# EAGLE design lichtenstein_controller (EAGLE 9.4.2)
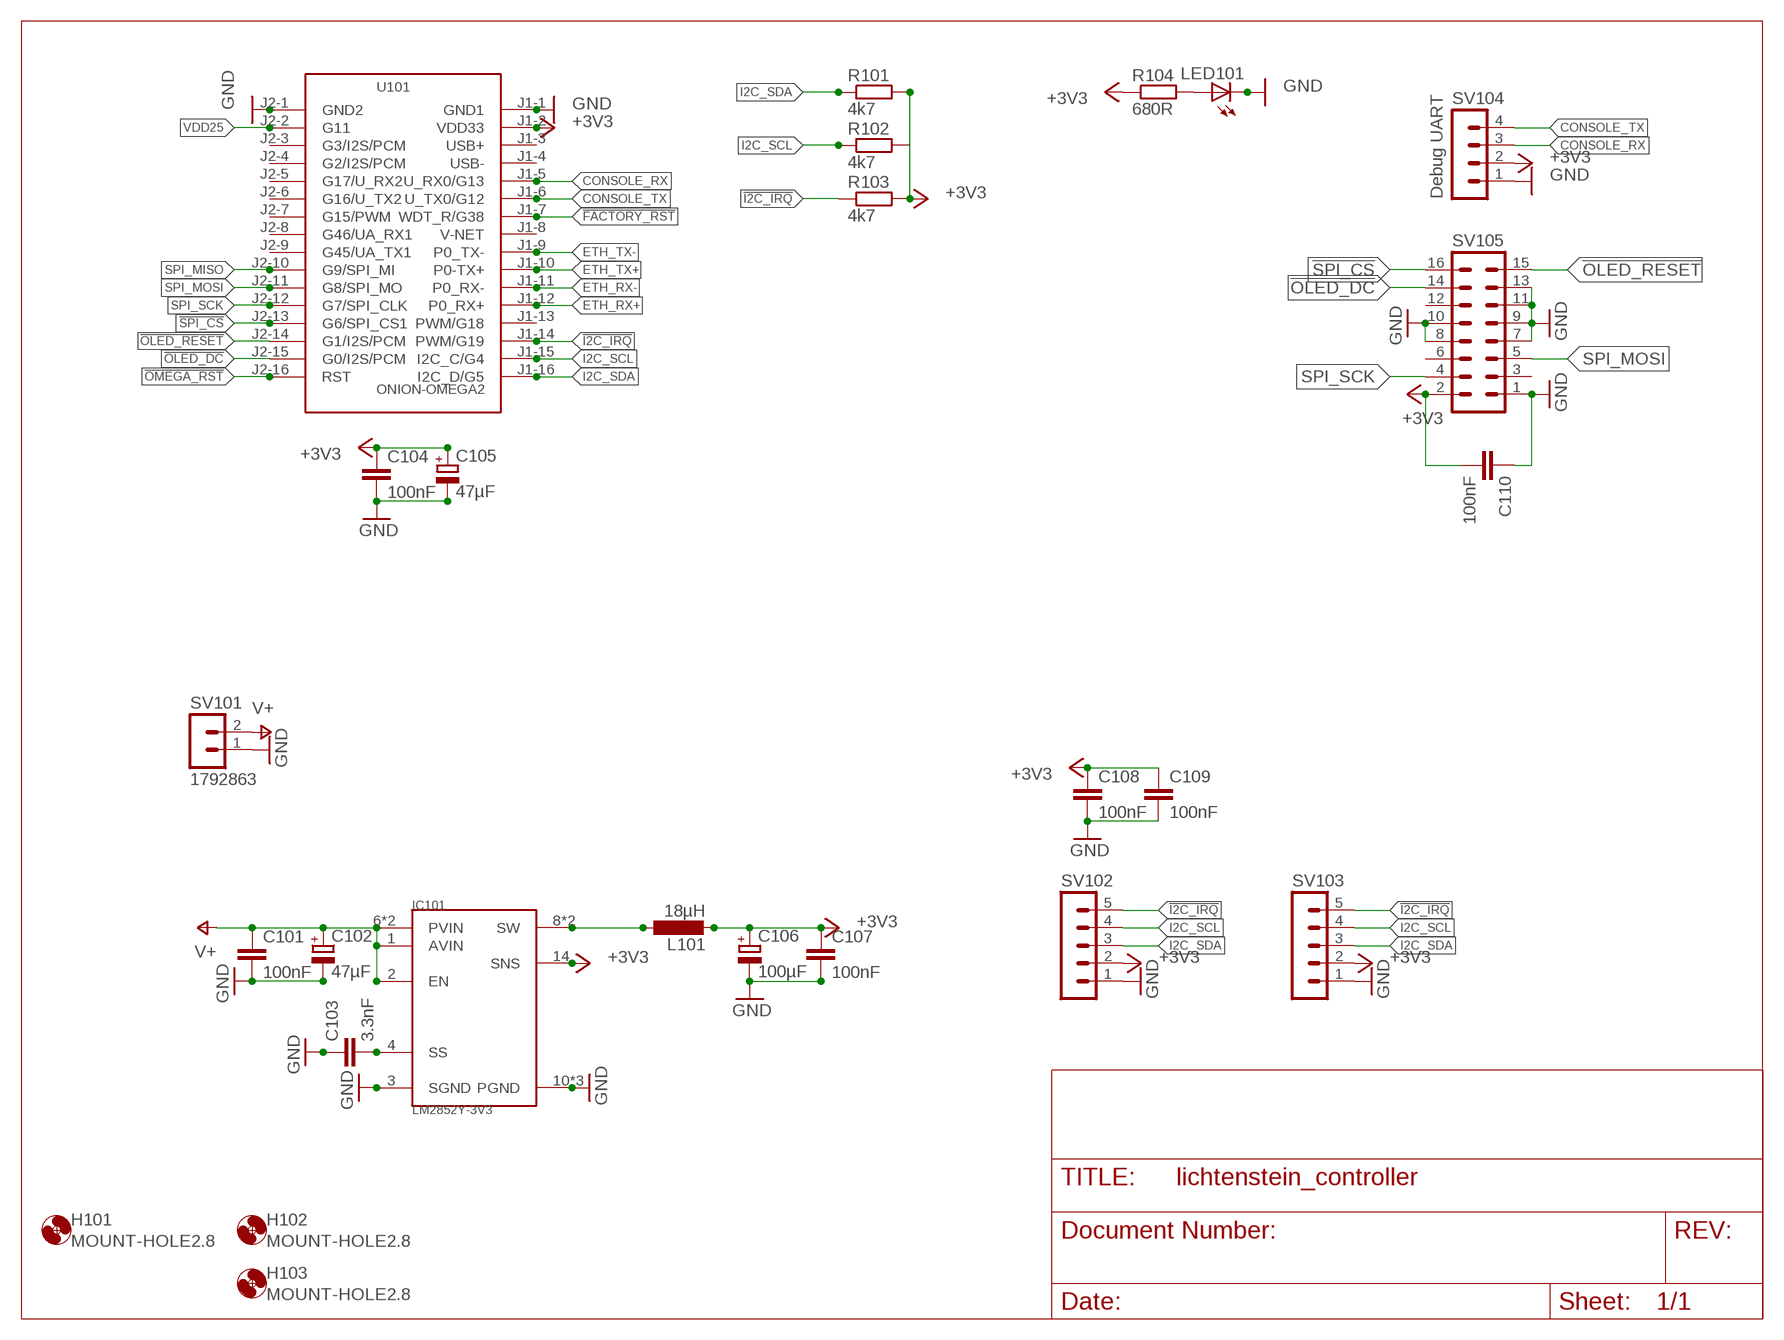
[diagram p0: schematic, sheet 1]

## Parts
C101  100nF  C-EUC0805  [C0805]
C102  47µF  CPOL-EUCT7343  [CT7343]
C103  3.3nF  C-EUC0805  [C0805]
C104  100nF  C-EUC0805  [C0805]
C105  47µF  CPOL-EUCT7343  [CT7343]
C106  100µF  CPOL-EUCT7343  [CT7343]
C107  100nF  C-EUC0805  [C0805]
C108  100nF  C-EUC0805  [C0805]
C109  100nF  C-EUC0805  [C0805]
C110  100nF  C-EUC0805  [C0805]
H101  MOUNT-HOLE2.8  [2,8]
H102  MOUNT-HOLE2.8  [2,8]
H103  MOUNT-HOLE2.8  [2,8]
IC101  LM2852Y-3V3  LM2852HTSSOP14  [HTSSOP14]
L101  18µH  SRR1050A  [SRR1050A]
LED101  LEDCHIPLED_1206  [CHIPLED_1206]
R101  4k7  R-EU_M0805  [M0805]
R102  4k7  R-EU_M0805  [M0805]
R103  4k7  R-EU_M0805  [M0805]
R104  680R  R-EU_M0805  [M0805]
SV101  1792863  [1792863]
SV102  MA05-1  [MA05-1]
SV103  MA05-1  [MA05-1]
SV104  MA04-1  [MA04-1]
SV105  MA08-2  [MA08-2]
U101  ONION-OMEGA2  [ONION-2MM-2X16]

## Nets
!FACTORY_RST: U101.J1-7(WDT_R/G38)
!I2C_IRQ: R103.1 SV102.5 SV103.5 U101.J1-14(PWM/G19)
!OLED_DC: SV105.14 U101.J2-15(G0/I2S/PCM)
!OLED_RESET: SV105.15 U101.J2-14(G1/I2S/PCM)
!OMEGA_RST: U101.J2-16(RST)
!SPI_CS: SV105.16 U101.J2-13(G6/SPI_CS1)
+3V3: C104.1 C105.+ C106.+ C107.1 C108.1 C109.1 C110.2 IC101.14(SNS) L101.P$2 R101.2 R102.2 R103.2 R104.1 SV102.2 SV103.2 SV104.2 SV105.2 U101.J1-2(VDD33)
CONSOLE_RX: SV104.3 U101.J1-5(U_RX0/G13)
CONSOLE_TX: SV104.4 U101.J1-6(U_TX0/G12)
ETH_RX+: U101.J1-12(P0_RX+)
ETH_RX-: U101.J1-11(P0_RX-)
ETH_TX+: U101.J1-10(P0-TX+)
ETH_TX-: U101.J1-9(P0_TX-)
GND: C101.2 C102.- C103.1 C104.2 C105.- C106.- C107.2 C108.2 C109.2 C110.1 IC101.3(SGND) IC101.10(PGND) IC101.11(PGND) IC101.PAD(PGND) LED101.C SV101.1 SV102.1 SV103.1 SV104.1 SV105.1 SV105.7 SV105.8 SV105.9 SV105.10 SV105.11 SV105.13 U101.J1-1(GND1) U101.J2-1(GND2)
I2C_SCL: R102.1 SV102.4 SV103.4 U101.J1-15(I2C_C/G4)
I2C_SDA: R101.1 SV102.3 SV103.3 U101.J1-16(I2C_D/G5)
N$1: LED101.A R104.2
N$7: IC101.8(SW) IC101.9(SW) L101.P$1
N$8: C103.2 IC101.4(SS)
SPI_MISO: U101.J2-10(G9/SPI_MI)
SPI_MOSI: SV105.5 U101.J2-11(G8/SPI_MO)
SPI_SCK: SV105.4 U101.J2-12(G7/SPI_CLK)
V+: C101.1 C102.+ IC101.1(AVIN) IC101.2(EN) IC101.6(PVIN) IC101.7(PVIN) SV101.2
VDD25: U101.J2-2(G11)
Unconnected: SV105.3 SV105.6 SV105.12 U101.J1-3(USB+) U101.J1-4(USB-) U101.J1-8(V-NET) U101.J1-13(PWM/G18) U101.J2-3(G3/I2S/PCM) U101.J2-4(G2/I2S/PCM) U101.J2-5(G17/U_RX2) U101.J2-6(G16/U_TX2) U101.J2-7(G15/PWM) U101.J2-8(G46/UA_RX1) U101.J2-9(G45/UA_TX1)

## Notes on the sheet
- Debug UART

## Library data of the parts
C101 C104 C107-C110 = rcl:C-EU: CAPACITOR, European symbol; MOUSER: 710-885012207072; SPICEPREFIX: C
C102 C105 = rcl:CPOL-EU: POLARIZED CAPACITOR, European symbol; MOUSER: 581-TAJD476M016RNJV; SPICEPREFIX: C
C103 = rcl:C-EU: CAPACITOR, European symbol; MOUSER: 710-885012207089; SPICEPREFIX: C
C106 = rcl:CPOL-EU: POLARIZED CAPACITOR, European symbol; MOUSER: 581-NOSD107M006; SPICEPREFIX: C
H101-H103 = holes:MOUNT-HOLE: MOUNTING HOLE with drill center marker
IC101 = lichtenstein_onion:LM2852: 2A 500/1500kHz Synchronous Buck Regulator Information <http://www.ti.com/product/lm2852/description>; MOUSER: 926-LM2852YMXA33NOPB
L101 = lichtenstein_onion:SRR1050A: SRR1050A Series - Shielded Power Inductors Datasheet <https://www.mouser.com/datasheet/2/54/rr1050a-964771.pdf>; MOUSER: 652-SRR1050A-180Y
LED101 = led:LED: LED OSRAM: - CHIPLED LG R971, LG N971, LY N971, LG Q971, LY Q971, LO R971, LY R971 LH N974, LH R974 LS Q976, LO Q976, LY Q976 LO Q996 - Hyper CHIPLED LW Q18S LB Q993, LB Q99A, LB R99A - SideLED LS A670, LO A670, LY A670, LG A670, LP A670 LB A673, LV A673, LT A673, LW A673 LH A674 LY A675 LS A676, LA A676, LO A676, LY A676, LW A676 LS A679, LY A679, LG A679 - Hyper Micro SIDELED® LS Y876, LA Y876, LO Y876, LY Y876 LT Y87S - SmartLED LW L88C, LW L88S LB L89C, LB L89S, LG L890 LS L89K, LO L89K, LY L89K LS L896, LA L896, LO L896, LY L896 - TOPLED LS T670, LO T670, LY T670, LG T670, LP T670 LSG T670, LSP T670, LSY T670, LOP T670, LYG T670 LG T671, LOG T671, LSG T671 LB T673, LV T673, LT T673, LW T673 LH T674 LS T676, LA T676, LO T676, LY T676, LB T676, LH T676, LSB T676, LW T676 LB T67C, LV T67C, LT T67C, LS T67K, LO T67K, LY T67K, LW E67C LS E67B, LA E67B, LO E67B, LY E67B, LB E67C, LV E67C, LT E67C LW T67C LS T679, LY T679, LG T679 LS T770, LO T770, LY T770, LG T770, LP T770 LB T773, LV T773, LT T773, LW T773 LH T774 LS E675, LA E675, LY E675, LS T675 LS T776, LA T776, LO T776, LY T776, LB T776 LHGB T686 LT T68C, LB T68C - Hyper Mini TOPLED® LB M676 - Mini TOPLED Santana® LG M470 LS M47K, LO M47K, LY M47K Source: http://www.osram.convergy.de LUXEON: - LUMILED® LXK2-PW12-R00, LXK2-PW12-S00, LXK2-PW14-U00, LXK2-PW14-V00 LXK2-PM12-R00, LXK2-PM12-S00, LXK2-PM14-U00 LXK2-PE12-Q00, LXK2-PE12-R00, LXK2-PE12-S00, LXK2-PE14-T00, LXK2-PE14-U00 LXK2-PB12-K00, LXK2-PB12-L00, LXK2-PB12-M00, LXK2-PB14-N00, LXK2-PB14-P00, LXK2-PB14-Q00 LXK2-PR12-L00, LXK2-PR12-M00, LXK2-PR14-Q00, LXK2-PR14-R00 LXK2-PD12-Q00, LXK2-PD12-R00, LXK2-PD12-S00 LXK2-PH12-R00, LXK2-PH12-S00 LXK2-PL12-P00, LXK2-PL12-Q00, LXK2-PL12-R00 Source: www.luxeon.com KINGBRIGHT: KA-3528ASYC Source: www.kingbright.com; MOUSER: 604-APTR3216SGC
R101-R103 = rcl:R-EU_: RESISTOR, European symbol; MOUSER: 652-CR0805-FX4701GLF; SPICEPREFIX: R
R104 = rcl:R-EU_: RESISTOR, European symbol; MOUSER: 652-CR0805-FX6800GLF; SPICEPREFIX: R
SV101 = lichtenstein_onion:1792863: PCB terminal block - PTS 1,5/ 2-5,0-H - 1792863 Footprint Proven Information <https://www.phoenixcontact.com/online/portal/us?uri=pxc-oc-itemdetail:pid=1792863&library=usen&tab=1>; MOUSER: 651-1792863
SV102 SV103 = con-lstb:MA05-1: PIN HEADER; OC_FARNELL: unknown; OC_NEWARK: unknown
SV104 = con-lstb:MA04-1: PIN HEADER; OC_FARNELL: unknown; OC_NEWARK: unknown
SV105 = con-lstb:MA08-2: PIN HEADER; OC_FARNELL: unknown; OC_NEWARK: unknown
U101 = lichtenstein_onion:ONION-OMEGA2: Onion Omega; MOUSER: 353-OM-O2P

## Board
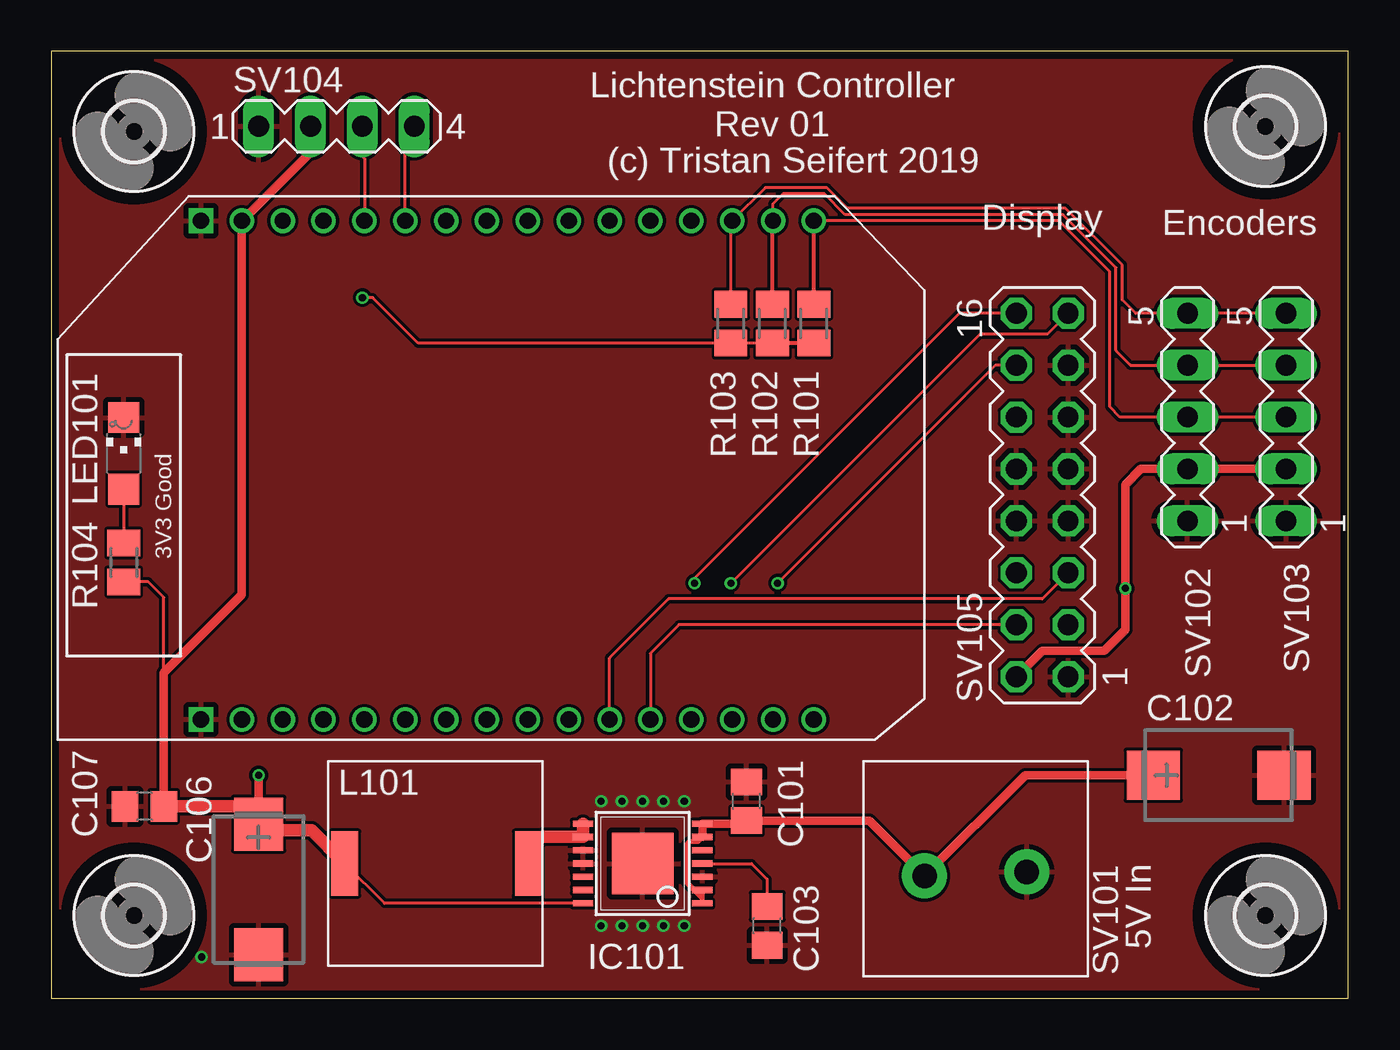
[diagram p1: board, top side]
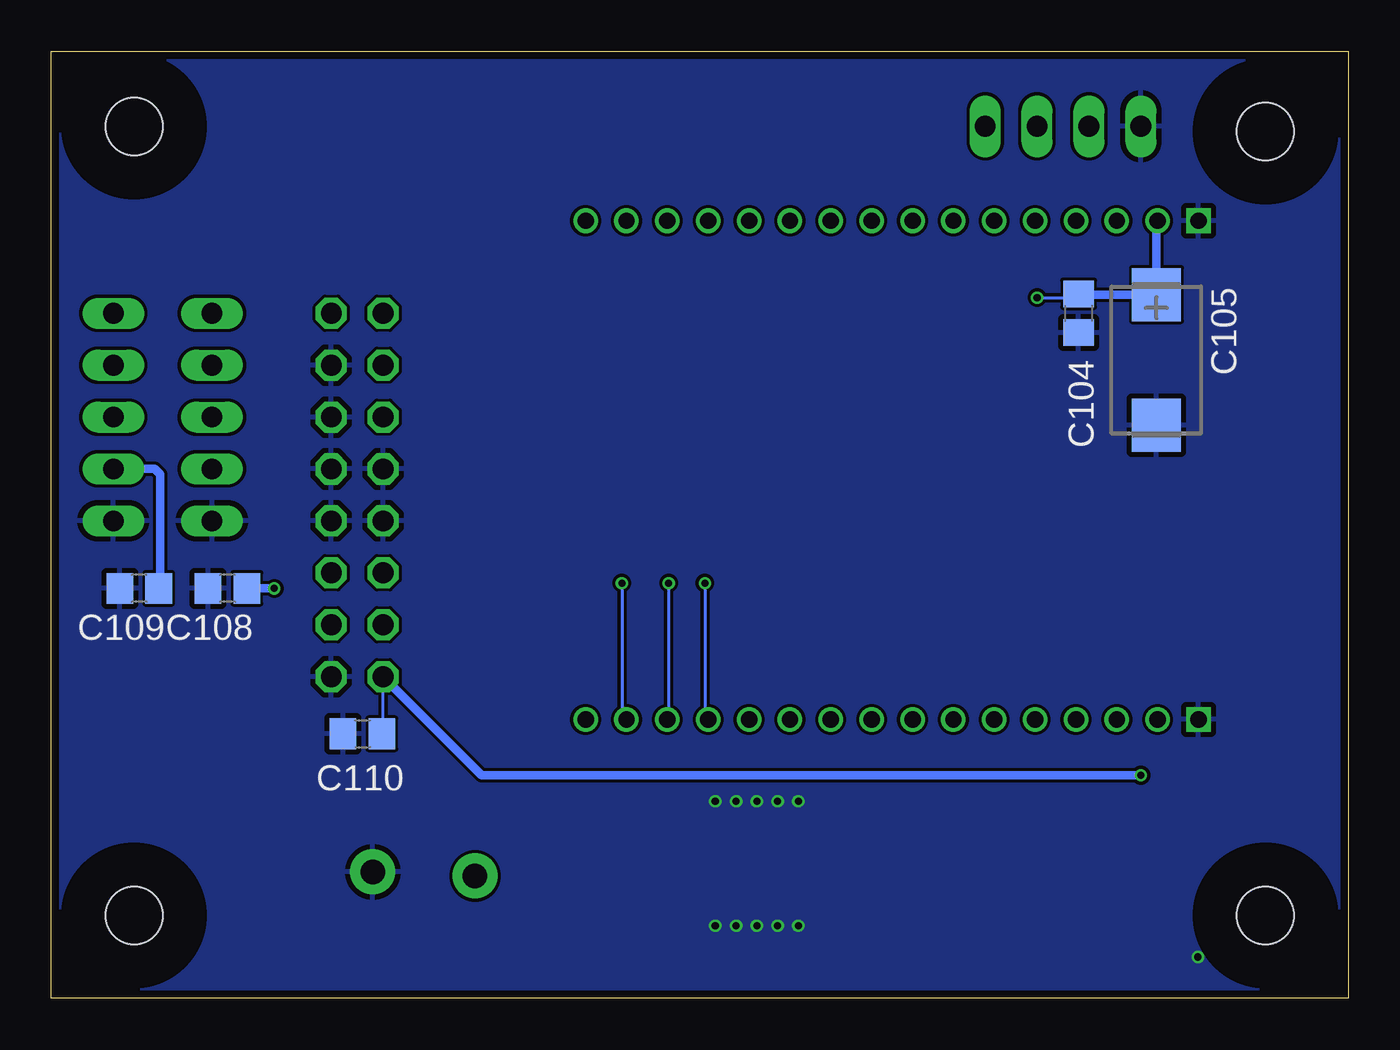
[diagram p2: board, bottom side, seen from below]

Size 63.5 x 46.35 mm. Coordinates in mm from the lower left corner, seen from the top.
Outline: 0,0 63.5,0 63.5,46.35 0,46.35 0,0
Copper layers (1*16): Top 0.035559375mm / dielectric 1.6mm / Bottom 0.035559375mm
Design rules "oshpark-2layer copy": minimum track width 6mil, minimum drill 10mil, track to track 6mil, track to pad 6mil, pad to pad 6mil, via to via 6mil, smd to smd 6mil, copper to edge 15mil, drill to drill 6mil, minimum pad ring 5mil, minimum via ring 5mil, stop-mask expansion 2.5mil, vias tented up to drill 0mil, thermal gap 10mil

### Footprints (pad centres in the part's own frame; a part is rotated, then mirrored left to right if it is on the bottom)
C0805 = smd 1.3 x 1.5: 1 -0.95,0; 2 0.95,0
CT7343 = smd 2.6 x 2.4: + -3.2,0; - 3.2,0
2,8 = hole 2.8: 0,0
HTSSOP14 = smd 0.305 x 0.991: 1 -1.95,-2.918; 2 -1.3,-2.918; 3 -0.65,-2.918; 4 0,-2.918; 5 0.65,-2.918; 6 1.3,-2.918; 7 1.95,-2.918; 8 1.95,2.918; 9 1.3,2.918; 10 0.65,2.918; 11 0,2.918; 12 -0.65,2.918; 13 -1.3,2.918; 14 -1.95,2.918 | smd 3 x 3: PAD 0,0
SRR1050A = smd 3.15 x 1.325: P$1 0,0; P$2 0,-9
CHIPLED_1206 = smd 1.5 x 1.5: A 0,-1.75; C 0,1.75
M0805 = smd 1.3 x 1.6: 1 -0.95,0; 2 0.95,0
1792863 = drill 1.2 pad 2.2: 1 0,-0.1; 2 5,0.1
MA05-1 = drill 1.016 long: 1 -5.08,0; 2 -2.54,0; 3 0,0; 4 2.54,0; 5 5.08,0
MA04-1 = drill 1.016 long: 1 -3.81,0; 2 -1.27,0; 3 1.27,0; 4 3.81,0
MA08-2 = drill 1.016 octagon: 1 -8.89,-1.27; 2 -8.89,1.27; 3 -6.35,-1.27; 4 -6.35,1.27; 5 -3.81,-1.27; 6 -3.81,1.27; 7 -1.27,-1.27; 8 -1.27,1.27; 9 1.27,-1.27; 10 1.27,1.27; 11 3.81,-1.27; 12 3.81,1.27; 13 6.35,-1.27; 14 6.35,1.27; 15 8.89,-1.27; 16 8.89,1.27
ONION-2MM-2X16 = drill 0.8 square: J1-1 12.4,14; J2-1 -12,14 | drill 0.8: J1-2 12.4,12; J1-3 12.4,10; J1-4 12.4,8; J1-5 12.4,6; J1-6 12.4,4; J1-7 12.4,2; J1-8 12.4,0; J1-9 12.4,-2; J1-10 12.4,-4; J1-11 12.4,-6; J1-12 12.4,-8; J1-13 12.4,-10; J1-14 12.4,-12; J1-15 12.4,-14; J1-16 12.4,-16; J2-2 -12,12; J2-3 -12,10; J2-4 -12,8; J2-5 -12,6; J2-6 -12,4; J2-7 -12,2; J2-8 -12,0; J2-9 -12,-2; J2-10 -12,-4; J2-11 -12,-6; J2-12 -12,-8; J2-13 -12,-10; J2-14 -12,-12; J2-15 -12,-14; J2-16 -12,-16

### Placement (x,y rotation side)
C101  34.04,9.65 90 top
C102  57.15,10.92 0 top
C103  35.05,3.56 90 top
C104  13.21,33.53 270 bottom
C105  9.4,31.24 270 bottom
C106  10.16,5.33 270 top
C107  4.57,9.4 180 top
C108  54.86,20.07 180 bottom
C109  59.18,20.07 180 bottom
C110  48.26,12.95 0 bottom
H4  MOUNT-HOLE2.8  [2,8]  59.44,4.06 0 top
H101  4.06,4.06 0 top
H102  4.06,42.42 0 top
H103  59.44,42.67 0 top
IC101  28.96,6.6 90 top
L101  23.37,6.6 270 top
LED101  3.56,26.67 0 top
R101  37.34,33.02 270 top
R102  35.31,33.02 270 top
R103  33.27,33.02 270 top
R104  3.56,21.34 90 top
SV101  47.75,6.1 180 top
SV102  55.63,28.45 90 top
SV103  60.45,28.45 90 top
SV104  13.97,42.67 0 top
SV105  48.51,24.64 90 top
U101  21.34,25.65 90 top

### Tracks (layer width: path | path; a pad name or v marks a point on that pad's centre or on a via)
!I2C_IRQ
  Top 0.152: R103.1 33.27,37.99 U101.J1-14 34.96,39.67 37.97,39.67 38.98,38.66 49.65,38.66 52.43,35.89 52.43,34.19 53.09,33.53 SV102.5 SV103.5
!OLED_DC  (via drill 0.35)
  Top 0.152: SV105.14 46.23,30.99 v35.56,20.32
  Bottom 0.152: v35.56,20.32 35.56,13.88 U101.J2-15
!OLED_RESET  (via drill 0.35)
  Top 0.152: SV105.15 48.77,32.51 45.47,32.51 v33.27,20.32
  Bottom 0.152: v33.27,20.32 33.27,13.72 U101.J2-14
!SPI_CS  (via drill 0.35)
  Top 0.152: SV105.16 44.45,33.53 31.5,20.57 v31.5,20.32
  Bottom 0.152: v31.5,20.32 31.5,13.81 U101.J2-13
+3V3  (via drill 0.35)
  Top 0.152: 10.46,8.23 C106.+ | IC101.14 16.32,4.65 L101.P$2 | 5.52,15.94 5.52,19.62 4.76,20.39 R104.1 | R102.2 R103.2 17.97,32.07 15.75,34.29 v15.24,34.29
  Top 0.2: R101.2 R102.2
  Top 0.406: SV104.2 12.7,41.4 9.35,38.05 U101.J1-2 9.34,19.75 5.52,15.94 C107.1 | v10.16,10.92 C106.+ | SV105.2 48.51,17.02 51.56,17.02 52.58,18.03 v52.58,20.07 52.58,25.15 53.34,25.91 SV102.2 SV103.2
  Top 0.61: L101.P$2 12.74,8.23 10.46,8.23 | C107.1 9.26,9.4 C106.+
  Bottom 0.152: C110.2 47.24,13.02 SV105.2 | v15.24,34.29 13.4,34.29 C104.1
  Bottom 0.406: U101.J1-2 9.4,37.99 C105.+ 13.17,34.44 C104.1 | SV105.2 42.42,10.92 v10.16,10.92 | SV103.2 58.42,25.91 58.17,25.65 58.17,20.13 C109.1 | C108.1 v52.58,20.07
CONSOLE_RX
  Top 0.152: SV104.3 15.24,41.2 15.34,41.1 U101.J1-5
CONSOLE_TX
  Top 0.152: U101.J1-6 17.34,42.23 SV104.4
GND  (via drill 0.35)
  other vias: 7.37,2.03 26.92,9.65 30.99,9.65 28.96,9.65 27.94,9.65 29.97,9.65 28.96,3.56 26.92,3.56 30.99,3.56 29.97,3.56 27.94,3.56
  pour Top: 0,46.61 0,46.35 0,0.25 63.5,0.25 63.5,46.61
  pour Bottom: 0,46.35 0,0 63.5,0 63.5,46.35
I2C_SCL
  Top 0.152: U101.J1-15 35.34,38.89 35.81,39.37 37.85,39.37 38.86,38.36 49.53,38.36 52.12,35.76 52.12,31.7 52.83,30.99 SV102.4 SV103.4
  Top 0.2: R102.1 35.31,38.02 U101.J1-15
I2C_SDA
  Top 0.152: U101.J1-16 49.32,38.05 51.82,35.56 51.82,28.96 52.32,28.45 SV102.3 SV103.3
  Top 0.2: R101.1 U101.J1-16
N$1
  Top 0.152: LED101.A R104.2
N$7
  Top 0.254: 23.71,7.55 23.62,7.11 23.37,6.86 L101.P$1
  Top 0.508: 24.06,7.9 23.71,7.55
  Top 0.61: IC101.8 IC101.9 24.06,7.9
N$8
  Top 0.152: C103.2 35.05,5.84 34.29,6.6 IC101.4
SPI_MOSI
  Top 0.152: SV105.5 48.51,19.56 30.23,19.56 27.34,16.67 U101.J2-11
SPI_SCK
  Top 0.152: SV105.4 30.73,18.29 29.34,16.89 U101.J2-12
V+
  Top 0.254: IC101.2 IC101.1 31.87,4.91 31.1,5.69 31.1,7.52 31.26,7.69 31.66,7.69 IC101.6 | 33.89,8.55 C101.1
  Top 0.406: IC101.6 IC101.7 33.89,8.55 | C101.1 40.05,8.7 SV101.2 47.68,10.92 C102.+

### Text on the board
tNames: Lichtenstein Controller / Rev 01 | (c) Tristan Seifert 2019 | Display | Encoders | 3V3 Good | 5V In